# Altium project roach2_project rev2.PrjPCB (part 2 of 13)

## Sheet gpio_led.SchDoc: GPIO and LEDs
size A3; Date: DO NOT USE, RATHER USE PROJ OPTIONS; DrawnBy: DO NOT USE, RATHER USE PROJ OPTIONS; Engineer: DO NOT USE, RATHER USE PROJ OPTIONS; Organization: DO NOT USE, RATHER USE PROJ OPTIONS; DocumentNumber: DO NOT USE, RATHER USE PROJ OPTIONS; Revision: DO NOT USE, RATHER USE PROJ OPTIONS; SheetNumber: 25; SheetTotal: 27; SCH_Sheet_Filename: gpio_led.SchDoc; CurrentTime: DO NOT USE, RATHER USE PROJ OPTIONS; Time: DO NOT USE, RATHER USE PROJ OPTIONS; DocumentFullPathAndName: DO NOT USE, RATHER USE PROJ OPTIONS; DocumentName: DO NOT USE, RATHER USE PROJ OPTIONS; ModifiedDate: DO NOT USE, RATHER USE PROJ OPTIONS; ImagePath: DO NOT USE, RATHER USE PROJ OPTIONS
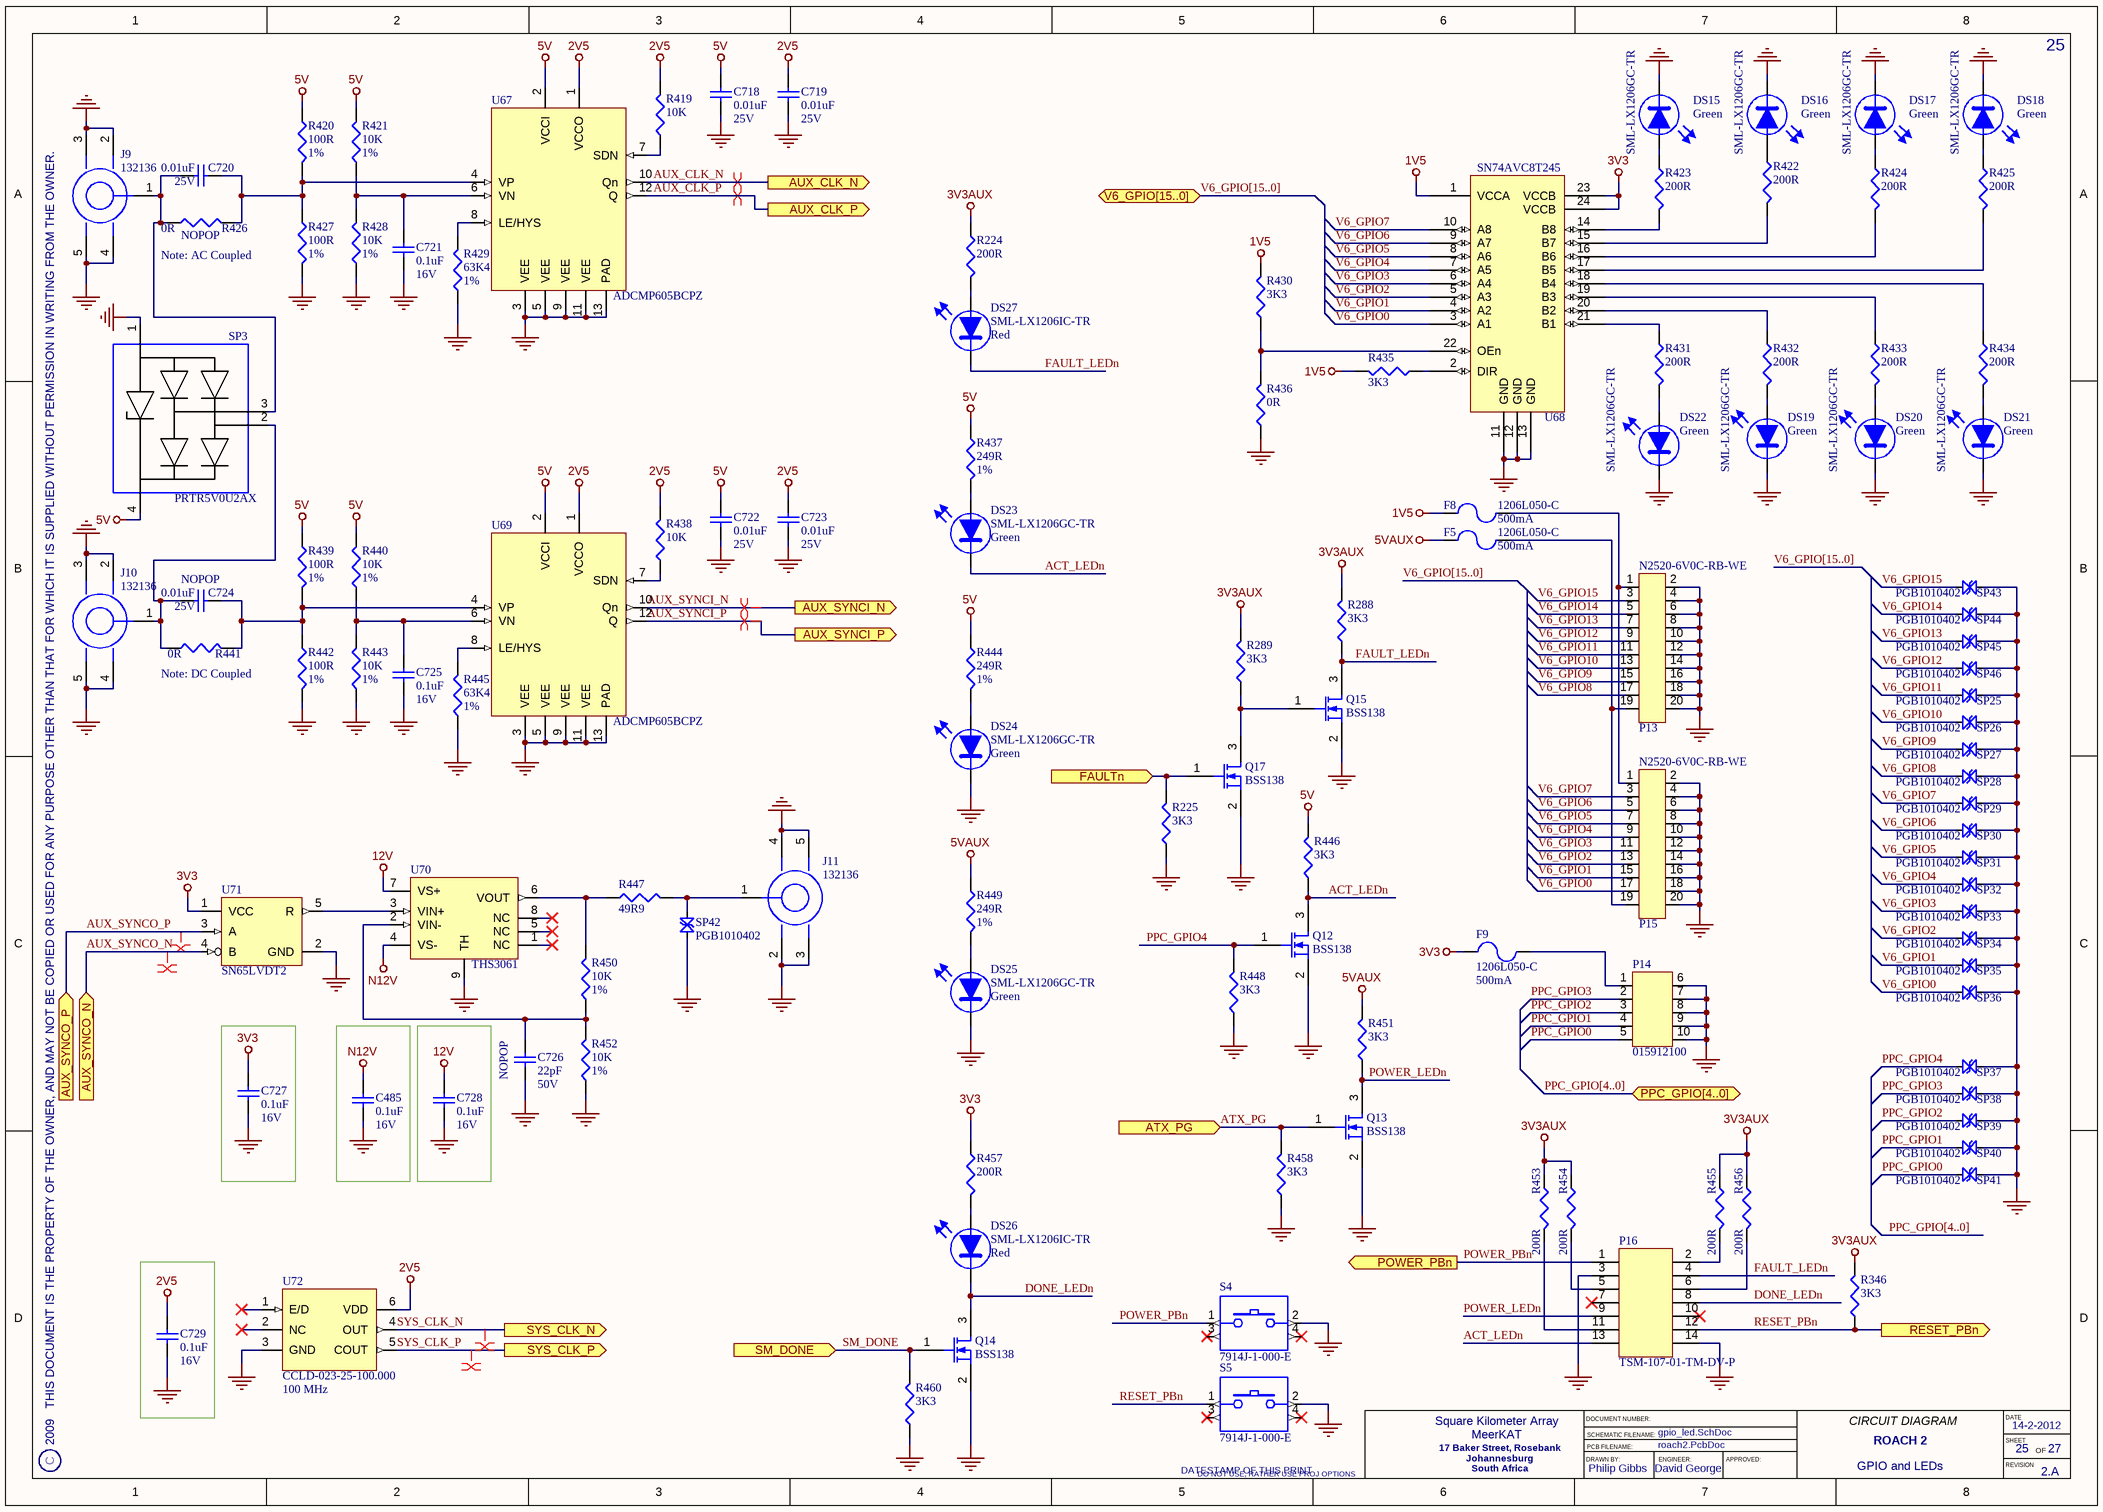
[diagram p3: gpio_led.SchDoc]

### Parts
C485  Rating: 16V  [CAPC1005X60L]  (hidden comment: 0.1uF)
C718  Rating: 25V  [CAPC1005X55L]  (hidden comment: 0.01uF)
C719  Rating: 25V  [CAPC1005X55L]  (hidden comment: 0.01uF)
C720  Rating: 25V  [CAPC1005X55L]  (hidden comment: 0.01uF)
C721  Rating: 16V  [CAPC1005X60L]  (hidden comment: 0.1uF)
C722  Rating: 25V  [CAPC1005X55L]  (hidden comment: 0.01uF)
C723  Rating: 25V  [CAPC1005X55L]  (hidden comment: 0.01uF)
C724  Rating: 25V  [CAPC1005X55L]  (hidden comment: 0.01uF)
C725  Rating: 16V  [CAPC1005X60L]  (hidden comment: 0.1uF)
C726  Rating: 50V  [CAPC1005X55L]  (hidden comment: 22pF)
C727  Rating: 16V  [CAPC1005X60L]  (hidden comment: 0.1uF)
C728  Rating: 16V  [CAPC1005X60L]  (hidden comment: 0.1uF)
C729  Rating: 16V  [CAPC1005X60L]  (hidden comment: 0.1uF)
DS15  SML-LX1206GC-TR  Colour: Green  [LEDC3216X120N]
DS16  SML-LX1206GC-TR  Colour: Green  [LEDC3216X120N]
DS17  SML-LX1206GC-TR  Colour: Green  [LEDC3216X120N]
DS18  SML-LX1206GC-TR  Colour: Green  [LEDC3216X120N]
DS19  SML-LX1206GC-TR  Colour: Green  [LEDC3216X120N]
DS20  SML-LX1206GC-TR  Colour: Green  [LEDC3216X120N]
DS21  SML-LX1206GC-TR  Colour: Green  [LEDC3216X120N]
DS22  SML-LX1206GC-TR  Colour: Green  [LEDC3216X120N]
DS23  SML-LX1206GC-TR  Colour: Green  [LEDC3216X120N]
DS24  SML-LX1206GC-TR  Colour: Green  [LEDC3216X120N]
DS25  SML-LX1206GC-TR  Colour: Green  [LEDC3216X120N]
DS26  SML-LX1206IC-TR  Colour: Red  [LEDC3216X120N]
DS27  SML-LX1206IC-TR  Colour: Red  [LEDC3216X120N]
F5  Rating: 500mA  [FUSMC3215X145]  (hidden comment: 1206L050-C)
F8  Rating: 500mA  [FUSMC3215X145]  (hidden comment: 1206L050-C)
F9  Rating: 500mA  [FUSMC3215X145]  (hidden comment: 1206L050-C)
J9  132136  [AMPHENOL_132134]
J10  132136  [AMPHENOL_132134]
J11  132136  [AMPHENOL_132134]
P13  N2520-6V0C-RB-WE  [3M_N2520-6V0C-RB-WE]
P14  015912100  [MOLEX_0015912100]
P15  N2520-6V0C-RB-WE  [3M_N2520-6V0C-RB-WE]
P16  TSM-107-01-TM-DV-P  [SAMTEC_TSM-107-01-TM-DV-P]
Q12  BSS138  [SOT95P245X110-3N]
Q13  BSS138  [SOT95P245X110-3N]
Q14  BSS138  [SOT95P245X110-3N]
Q15  BSS138  [SOT95P245X110-3N]
Q17  BSS138  [SOT95P245X110-3N]
R224  200R  [RESC1005X40L]
R225  3K3  [RESC1005X40L]
R288  3K3  [RESC1005X40L]
R289  3K3  [RESC1005X40L]
R346  3K3  [RESC1005X40L]
R419  10K  [RESC1005X40L]
R420  Tolerance: 1%  [RESC1005X40L]  (hidden comment: 100R)
R421  Tolerance: 1%  [RESC1005X40L]  (hidden comment: 10K)
R422  200R  [RESC1005X40L]
R423  200R  [RESC1005X40L]
R424  200R  [RESC1005X40L]
R425  200R  [RESC1005X40L]
R426  0R  [RESC1005X40L]
R427  Tolerance: 1%  [RESC1005X40L]  (hidden comment: 100R)
R428  Tolerance: 1%  [RESC1005X40L]  (hidden comment: 10K)
R429  Tolerance: 1%  [RESC1005X40L]  (hidden comment: 63K4)
R430  3K3  [RESC1005X40L]
R431  200R  [RESC1005X40L]
R432  200R  [RESC1005X40L]
R433  200R  [RESC1005X40L]
R434  200R  [RESC1005X40L]
R435  3K3  [RESC1005X40L]
R436  0R  [RESC1005X40L]
R437  Tolerance: 1%  [RESC1005X40L]  (hidden comment: 249R)
R438  10K  [RESC1005X40L]
R439  Tolerance: 1%  [RESC1005X40L]  (hidden comment: 100R)
R440  Tolerance: 1%  [RESC1005X40L]  (hidden comment: 10K)
R441  0R  [RESC1005X40L]
R442  Tolerance: 1%  [RESC1005X40L]  (hidden comment: 100R)
R443  Tolerance: 1%  [RESC1005X40L]  (hidden comment: 10K)
R444  Tolerance: 1%  [RESC1005X40L]  (hidden comment: 249R)
R445  Tolerance: 1%  [RESC1005X40L]  (hidden comment: 63K4)
R446  3K3  [RESC1005X40L]
R447  49R9  [RESC1005X40L]
R448  3K3  [RESC1005X40L]
R449  Tolerance: 1%  [RESC1005X40L]  (hidden comment: 249R)
R450  Tolerance: 1%  [RESC1005X40L]  (hidden comment: 10K)
R451  3K3  [RESC1005X40L]
R452  Tolerance: 1%  [RESC1005X40L]  (hidden comment: 10K)
R453  200R  [RESC1005X40L]
R454  200R  [RESC1005X40L]
R455  200R  [RESC1005X40L]
R456  200R  [RESC1005X40L]
R457  200R  [RESC1005X40L]
R458  3K3  [RESC1005X40L]
R460  3K3  [RESC1005X40L]
S4  7914J-1-000-E  [7914J-X-XXX-X]
S5  7914J-1-000-E  [7914J-X-XXX-X]
SP3  PRTR5V0U2AX  [SOT192P237X120-4N]
SP25  PGB1010402  [PGB1010402]
SP26  PGB1010402  [PGB1010402]
SP27  PGB1010402  [PGB1010402]
SP28  PGB1010402  [PGB1010402]
SP29  PGB1010402  [PGB1010402]
SP30  PGB1010402  [PGB1010402]
SP31  PGB1010402  [PGB1010402]
SP32  PGB1010402  [PGB1010402]
SP33  PGB1010402  [PGB1010402]
SP34  PGB1010402  [PGB1010402]
SP35  PGB1010402  [PGB1010402]
SP36  PGB1010402  [PGB1010402]
SP37  PGB1010402  [PGB1010402]
SP38  PGB1010402  [PGB1010402]
SP39  PGB1010402  [PGB1010402]
SP40  PGB1010402  [PGB1010402]
SP41  PGB1010402  [PGB1010402]
SP42  PGB1010402  [PGB1010402]
SP43  PGB1010402  [PGB1010402]
SP44  PGB1010402  [PGB1010402]
SP45  PGB1010402  [PGB1010402]
SP46  PGB1010402  [PGB1010402]
U67  ADCMP605BCPZ  [LFCSP_VQ-12]
U68  SN74AVC8T245  [PW024]
U69  ADCMP605BCPZ  [LFCSP_VQ-12]
U70  THS3061  [PW08]
U71  SN65LVDT2  [SOT23-5]
U72  Frequency: 100 MHz  [CCLD-023X-XX-XXX_XXX]  (hidden comment: CCLD-023-25-100.000)

### Ports
ATX_PG (in), AUX_CLK_N (out), AUX_CLK_P (out), AUX_SYNCI_N (out), AUX_SYNCI_P (out), AUX_SYNCO_N (in), AUX_SYNCO_P (in), FAULTn (in), POWER_PBn (out), PPC_GPIO[4..0] (bidir), RESET_PBn (out), SM_DONE (in), SYS_CLK_N (out), SYS_CLK_P (out), V6_GPIO[15..0] (bidir)

### Nets
1V5: F8.1 R430.2 R435.2 U68.1(VCCA)
2V5: C719.2 C723.2 C729.2 R419.2 R438.2 U67.1(VCCO) U69.1(VCCO) U72.6(VDD)
3V3: C727.2 F9.2 R457.1 U68.23(VCCB) U68.24(VCCB) U71.1(VCC)
3V3AUX: R224.1 R288.2 R289.2 R346.2 R453.1 R454.1 R455.1 R456.1
5V: C718.2 C722.2 R420.1 R421.2 R437.1 R439.1 R440.2 R444.1 R446.2 SP3.4(VCC) U67.2(VCCI) U69.2(VCCI)
5VAUX: F5.1 R449.1 R451.2
12V: C728.2 U70.7(VS+)
GND: C485.1 C718.1 C719.1 C721.1 C722.1 C723.1 C725.1 C726.1 C727.1 C728.1 C729.1 DS15.1(K) DS16.1(K) DS17.1(K) DS18.1(K) DS19.1(K) DS20.1(K) DS21.1(K) DS22.1(K) DS24.1(K) DS25.1(K) J9.2(SH) J9.3(SH) J9.4(SH) J9.5(SH) J10.2(SH) J10.3(SH) J10.4(SH) J10.5(SH) J11.2(SH) J11.3(SH) J11.4(SH) J11.5(SH) P13.2 P13.4 P13.6 P13.8 P13.10 P13.12 P13.14 P13.16 P13.18 P13.20 P14.6 P14.7 P14.8 P14.9 P14.10 P15.2 P15.4 P15.6 P15.8 P15.10 P15.12 P15.14 P15.16 P15.18 P15.20 P16.3 P16.14 Q12.2(S) Q13.2(S) Q14.2(S) Q15.2(S) Q17.2(S) R225.1 R427.2 R428.1 R429.1 R436.1 R442.2 R443.1 R445.1 R448.1 R452.1 R458.1 R460.1 S4.2 S5.2 SP3.1(GND) SP25.1(A) SP26.1(A) SP27.1(A) SP28.1(A) SP29.1(A) SP30.1(A) SP31.1(A) SP32.1(A) SP33.1(A) SP34.1(A) SP35.1(A) SP36.1(A) SP37.1(A) SP38.1(A) SP39.1(A) SP40.1(A) SP41.1(A) SP42.2(B) SP43.1(A) SP44.1(A) SP45.1(A) SP46.1(A) U67.3(VEE) U67.5(VEE) U67.9(VEE) U67.11(VEE) U67.13(PAD) U68.11(GND) U68.12(GND) U68.13(GND) U69.3(VEE) U69.5(VEE) U69.9(VEE) U69.11(VEE) U69.13(PAD) U70.9(TH) U71.2(GND) U72.3(GND)
N12V: C485.2 U70.4(VS-)
ACT_LEDn: DS23.1(K) P16.13 Q12.3(D) R446.1
ATX_PG: Q13.1(G) R458.2 ; port ATX_PG
AUX_CLK_N: U67.10(Qn) ; port AUX_CLK_N
AUX_CLK_P: U67.12(Q) ; port AUX_CLK_P
AUX_SYNCI_N: U69.10(Qn) ; port AUX_SYNCI_N
AUX_SYNCI_P: U69.12(Q) ; port AUX_SYNCI_P
AUX_SYNCO_N: U71.4(B) ; port AUX_SYNCO_N
AUX_SYNCO_P: U71.3(A) ; port AUX_SYNCO_P
DONE_LEDn: DS26.1(K) P16.8 Q14.3(D)
FAULT_LEDn: DS27.1(K) P16.4 Q15.3(D) R288.1
FAULTn: Q17.1(G) R225.2 ; port FAULTn
POWER_LEDn: P16.9 Q13.3(D) R451.1
POWER_PBn: P16.1 S4.1 ; port POWER_PBn
PPC_GPIO0: P14.5 SP41.2(B)
PPC_GPIO1: P14.4 SP40.2(B)
PPC_GPIO2: P14.3 SP39.2(B)
PPC_GPIO3: P14.2 SP38.2(B)
PPC_GPIO4: Q12.1(G) R448.2 SP37.2(B)
RESET_PBn: P16.12 R346.1 S5.1 ; port RESET_PBn
SM_DONE: Q14.1(G) R460.2 ; port SM_DONE
SYS_CLK_N: U72.4(OUT) ; port SYS_CLK_N
SYS_CLK_P: U72.5(COUT) ; port SYS_CLK_P
V6_GPIO0: P15.17 SP36.2(B) U68.3(A1)
V6_GPIO1: P15.15 SP35.2(B) U68.4(A2)
V6_GPIO2: P15.13 SP34.2(B) U68.5(A3)
V6_GPIO3: P15.11 SP33.2(B) U68.6(A4)
V6_GPIO4: P15.9 SP32.2(B) U68.7(A5)
V6_GPIO5: P15.7 SP31.2(B) U68.8(A6)
V6_GPIO6: P15.5 SP30.2(B) U68.9(A7)
V6_GPIO7: P15.3 SP29.2(B) U68.10(A8)
V6_GPIO8: P13.17 SP28.2(B)
V6_GPIO9: P13.15 SP27.2(B)
V6_GPIO10: P13.13 SP26.2(B)
V6_GPIO11: P13.11 SP25.2(B)
V6_GPIO12: P13.9 SP46.2(B)
V6_GPIO13: P13.7 SP45.2(B)
V6_GPIO14: P13.5 SP44.2(B)
V6_GPIO15: P13.3 SP43.2(B)
NetC720_1: C720.1 R420.2 R426.2 R427.1 U67.4(VP)
NetC720_2: C720.2 J9.1(IN) R426.1 SP3.3(IO2)
NetC721_2: C721.2 R421.1 R428.2 U67.6(VN)
NetC724_1: C724.1 R439.2 R441.2 R442.1 U69.4(VP)
NetC724_2: C724.2 J10.1(IN) R441.1 SP3.2(IO1)
NetC725_2: C725.2 R440.1 R443.2 U69.6(VN)
NetC726_2: C726.2 R450.1 R452.2 U70.2(VIN-)
NetDS15_2: DS15.2(A) R423.1
NetDS16_2: DS16.2(A) R422.1
NetDS17_2: DS17.2(A) R424.1
NetDS18_2: DS18.2(A) R425.1
NetDS19_2: DS19.2(A) R432.2
NetDS20_2: DS20.2(A) R433.2
NetDS21_2: DS21.2(A) R434.2
NetDS22_2: DS22.2(A) R431.2
NetDS23_2: DS23.2(A) R437.2
NetDS24_2: DS24.2(A) R444.2
NetDS25_2: DS25.2(A) R449.2
NetDS26_2: DS26.2(A) R457.2
NetDS27_2: DS27.2(A) R224.2
NetF5_2: F5.2 P13.19 P15.19
NetF8_2: F8.2 P13.1 P15.1
NetF9_1: F9.1 P14.1
NetJ11_1: J11.1(IN) R447.2 SP42.1(A)
NetP16_2: P16.2 R455.2
NetP16_5: P16.5 R454.2
NetP16_6: P16.6 R456.2
NetP16_11: P16.11 R453.2
NetQ15_1: Q15.1(G) Q17.3(D) R289.1
NetR419_1: R419.1 U67.7(SDN)
NetR422_2: R422.2 U68.15(B7)
NetR423_2: R423.2 U68.14(B8)
NetR424_2: R424.2 U68.16(B6)
NetR425_2: R425.2 U68.17(B5)
NetR429_2: R429.2 U67.8(LE/HYS)
NetR430_1: R430.1 R436.2 U68.22(OEn)
NetR431_1: R431.1 U68.21(B1)
NetR432_1: R432.1 U68.20(B2)
NetR433_1: R433.1 U68.19(B3)
NetR434_1: R434.1 U68.18(B4)
NetR435_1: R435.1 U68.2(DIR)
NetR438_1: R438.1 U69.7(SDN)
NetR445_2: R445.2 U69.8(LE/HYS)
NetR447_1: R447.1 R450.2 U70.6(VOUT)
NetU70_3: U70.3(VIN+) U71.5(R)

Not connected (* = marked no-connect by the designer): P16 7* 10*; S4 3* 4*; S5 3* 4*; U70 1(NC)* 5(NC)* 8(NC)*; U72 1(E/D)* 2(NC)*

### Buses and harness runs
bus PPC_GPIO[4..0]
bus PPC_GPIO[4..0] = port PPC_GPIO[4..0]
bus V6_GPIO[15..0]
bus V6_GPIO[15..0] = port V6_GPIO[15..0]

### Layout directives
differential pair: AUX_CLK_N, AUX_CLK_P, AUX_SYNCI_N, AUX_SYNCI_P, AUX_SYNCO_N, AUX_SYNCO_P, SYS_CLK_N, SYS_CLK_P

### Notes on the sheet
- (near R426) NOPOP
- Note: AC Coupled
- (near C724) NOPOP
- Note: DC Coupled
- (near C726) NOPOP
- 2009   THIS DOCUMENT IS THE PROPERTY OF THE OWNER, AND MAY NOT BE COPIED OR USED FOR ANY PURPOSE OTHER THAN THAT FOR WHICH IT IS SUPPLIED WITHOUT PERMISSION IN WRITING FROM THE OWNER.
- C
- DATESTAMP OF THIS PRINT
- DRAWN BY:
- DOCUMENT NUMBER:
- SCHEMATIC FILENAME:
- PCB FILENAME:
- ENGINEER:
- APPROVED:
- CIRCUIT DIAGRAM
- DATE
- SHEET
- REVISION
- OF

### Library data of the parts
C485 C721 C725 C727-C729 = CAP-CER-1: as C493 on sheet hwmon_2; POD number: CAP-CER-1; Value: 0.1uF; RoHS: Y; Sort Value: 0.1; Category: Capacitors; Subcategory: Ceramic
C718-C720 C722-C724 = CAP-CER-6: as C663 on sheet ddr3; POD number: CAP-CER-6; Value: 0.01uF; RoHS: Y; Sort Value: 0.01; Category: Capacitors; Subcategory: Ceramic
C726 = CAP-CER-2: 22pF, Ceramic Capacitor; Manufacturer: MURATA; PartNum: GRM1555C1H220JZ01D; Tolerance: 5%; Dielectric: C0G; POD number: CAP-CER-2; Value: 22pF; RoHS: Y; Sort Value: 0.000022; Category: Capacitors; Subcategory: Ceramic
DS15-DS25 = OPTO-LED-0: Green, Surface mount, LED, 1206; Manufacturer: LUMEX; Vdrop: 2.2V; Rating: 20mA; POD number: OPTO-LED-0; PartNum: SML-LX1206GC-TR; RoHS: Y; Category: OPTO; Subcategory: LED
DS26 DS27 = OPTO-LED-1: Red, Surface mount, LED, 1206; Manufacturer: LUMEX; Vdrop: 2V; Rating: 20mA; POD number: OPTO-LED-1; PartNum: SML-LX1206IC-TR; RoHS: Y; Category: OPTO; Subcategory: LED
F5 F8 F9 = ELMECH-FUSE-0: Resettable, Surface mount Fuse; Manufacturer: Littelfuse; POD number: ELMECH-FUSE-0; PartNum: 1206L050-C; RoHS: Y; Category: ELMECH; Subcategory: Fuses
J9-J11 = CONN-PCB-17: PCB-Mounted, Vertical, SMA Connector; Manufacturer: Amphenol; POD number: CONN-PCB-17; PartNum: 132136; RoHS: Y; Category: CONN; Subcategory: PCB
P13 P15 = CONN-PCB-10: 2x10, 2.54mm Pitch, Male Shrouded Header; Manufacturer: 3M; POD number: CONN-PCB-10; PartNum: N2520-6V0C-RB-WE; RoHS: Y; Category: CONN; Subcategory: PCB
P14 = CONN-PCB-12: 2x5, 2.54 mm Pitch, Male Header; Manufacturer: Molex; POD number: CONN-PCB-12; PartNum: 015912100; RoHS: Y; Category: CONN; Subcategory: PCB
P16 = CONN-PCB-16: 2x7, 2.54 mm Pitch, Male Header; Manufacturer: SAMTEC; POD number: CONN-PCB-16; PartNum: TSM-107-01-TM-DV-P; RoHS: Y; Category: CONN; Subcategory: PCB
Q12-Q15 Q17 = TRANS-NFET-0: as Q5 on sheet hwmon_2; POD number: TRANS-NFET-0; PartNum: BSS138; RoHS: Y; Category: TRANS; Subcategory: NFET
R224 R422-R425 R431-R434 R453-R457 = RES-TF-19: 200R, 1.1mm x 0.5mm, Thick Film Resistor; Manufacturer: ROYALOHM; PartNum: 0402WGF0201T1E; Tolerance: 1%; Rating: 0.0625W; POD number: RES-TF-19; Value: 200R; Sort Value: 200; Category: Resistors; Subcategory: ThickFilm; HelpURL: *.pdf
R225 R288 R289 R346 R430 R435 R446 R448 R451 R458 R460 = RES-TF-7: as R376 on sheet ddr3; POD number: RES-TF-7; Value: 3K3; Sort Value: 3300; Category: Resistors; Subcategory: ThickFilm; HelpURL: *.pdf
R419 R438 = RES-TF-5: as R32 on sheet hwmon_2; POD number: RES-TF-5; Value: 10K; Sort Value: 10000; Category: Resistors; Subcategory: ThickFilm; HelpURL: *.pdf
R420 R427 R439 R442 = RES-TF-14: as R381 on sheet ddr3; POD number: RES-TF-14; Value: 100R; Sort Value: 1000; Category: Resistors; Subcategory: ThickFilm; HelpURL: *.pdf
R421 R428 R440 R443 R450 R452 = RES-TF-20: as R41 on sheet hwmon_2; POD number: RES-TF-20; Value: 10K; Sort Value: 10000; Category: Resistors; Subcategory: ThickFilm; HelpURL: *.pdf
R426 R436 R441 = RES-TF-0: as R378 on sheet ddr3; POD number: RES-TF-0; Value: 0R; Sort Value: 0; Category: Resistors; Subcategory: ThickFilm; HelpURL: *.pdf
R429 R445 = RES-TF-33: 63K4, 1.1mm x 0.5mm, Thick Film Resistor; Manufacturer: ROYALOHM; PartNum: 0402WGF6342T1E; Rating: 0.0625W; POD number: RES-TF-33; Value: 63K4; Sort Value: 63400; Category: Resistors; Subcategory: ThickFilm; HelpURL: *.pdf
R437 R444 R449 = RES-TF-15: 249R, 1.1mm x 0.5mm, Thick Film Resistor; Manufacturer: ROYALOHM; PartNum: 0402WGF2490T1E; Rating: 0.0625W; POD number: RES-TF-15; Value: 249R; Sort Value: 249; Category: Resistors; Subcategory: ThickFilm; HelpURL: *.pdf
R447 = RES-TF-10: 49R9, 1.1mm x 0.5mm, Thick Film Resistor; Manufacturer: ROYALOHM; PartNum: 0402WGF499JT1E; Tolerance: 1%; Rating: 0.0625W; POD number: RES-TF-10; Value: 49R9; Sort Value: 49.9; Category: Resistors; Subcategory: ThickFilm; HelpURL: *.pdf
S4 S5 = ELMECH-SW-1: 4mm, Surface mount, Sealed Key Switch; Manufacturer: BOURNS; POD number: ELMECH-SW-1; PartNum: 7914J-1-000-E; RoHS: Y; Category: ELMECH; Subcategory: Switches
SP3 = ELMECH-ESD-1: Ultra-low capacitance, double rail-to-rail, ESD protection diode in a SOT143B package; Manufacturer: NXP; POD number: ELMECH-ESD-1; PartNum: PRTR5V0U2AX; RoHS: Y; Category: ELMECH; Subcategory: ESD Suppressors
SP25-SP46 = ELMECH-ESD-3: Surface Mount Polymeric ESD Suppressor in an 0402 package; POD number: ELMECH-ESD-3; PartNum: PGB1010402
U67 U69 = IC-LOG-7: Rail-to-Rail, Very Fast, 2.5 V to 5.5 V, Single-Supply LVDS Comparators; Manufacturer: Analog Devices; POD number: IC-LOG-7; PartNum: ADCMP605BCPZ; RoHS: Y; Category: IC; Subcategory: Logic
U68 = IC-LOG-10: 8-BIT DUAL-SUPPLY BUS TRANSCEIVER  WITH CONFIGURABLE VOLTAGE TRANSLATION AND 3-STATE OUTPUTS; Manufacturer: Texas Instruments; POD number: IC-LOG-10; PartNum: SN74AVC8T245; RoHS: Y; Category: IC; Subcategory: Logic
U70 = IC-AMP-1: LOW-DISTORTION, HIGH SLEW RATE, CURRENT-FEEDBACK AMPLIFIERS; Manufacturer: Texas Instruments; PartNum: THS3061DGN; POD number: IC-AMP-1; RoHS: Y; Category: IC; Subcategory: Amplifiers
U71 = IC-LOG-8: Single High-Speed Differential Line Receiver with ODT; Manufacturer: Texas Instruments; POD number: IC-LOG-8; PartNum: SN65LVDT2; RoHS: Y; Category: IC; Subcategory: Logic
U72 = RESN-CLK-2: 100.00 MHz, Low-Jitter Differential LVDS Clock Oscillator; Manufacturer: Crystek; Stability: 25 PPM; POD number: RESN-CLK-2; PartNum: CCLD-023-25-100.000; RoHS: Y; Category: RESN; Subcategory: Clock Oscillators